# Altium schematic sheet 01 COVER PAGE.SchDoc: COVER PAGE
size 420 x 297 mm; SheetNumber: 2; SheetTotal: 2
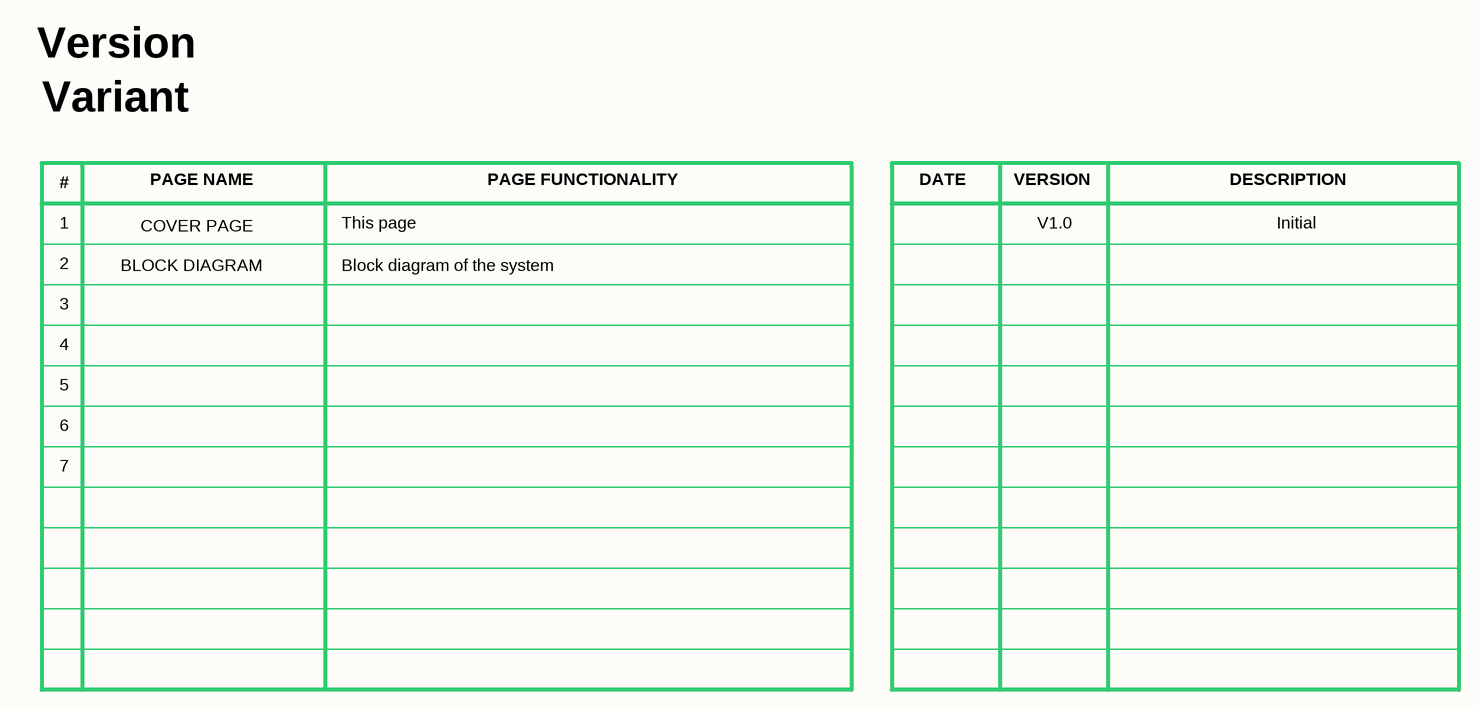
[diagram p0: 01 COVER PAGE.SchDoc]

## Notes on the sheet
- Version
- Variant
- #
- 1
- PAGE NAME
- COVER PAGE
- This page
- PAGE FUNCTIONALITY
- DATE
- VERSION
- V1.0
- DESCRIPTION
- Initial
- 2
- 3
- BLOCK DIAGRAM
- Block diagram of the system
- 4
- 5
- 6
- 7
- Title
- Project
- Size
- Date
- Revision
- A3
- Designed By